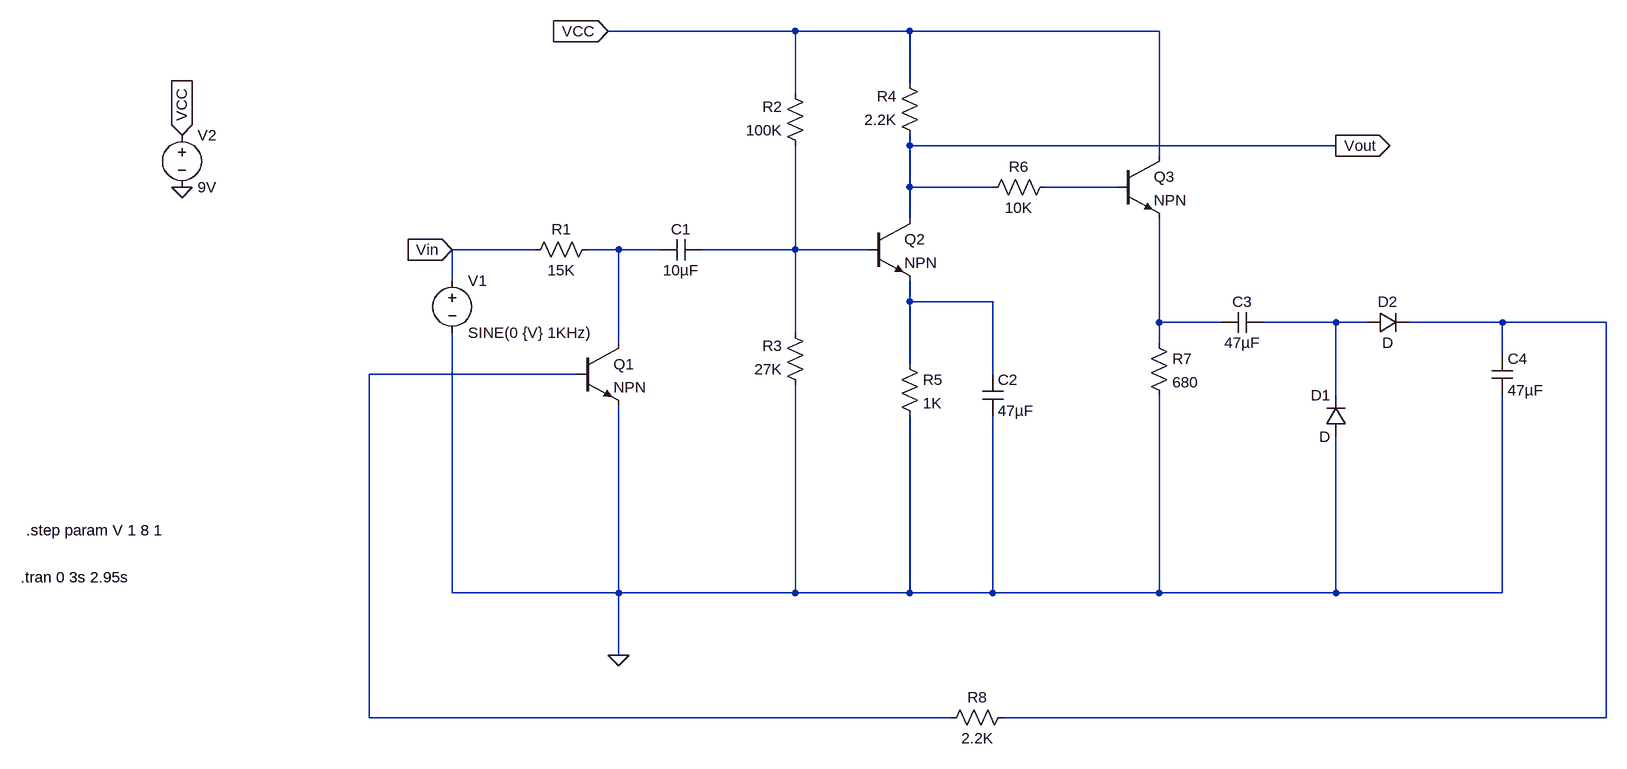
[diagram p0: schematic agc_BJT.asc]
agc_BJT.asc, the LTspice schematic file:
Version 4
SHEET 1 1796 864
WIRE 544 -240 256 -240
WIRE 720 -240 544 -240
WIRE 1104 -240 720 -240
WIRE 720 -160 720 -240
WIRE 544 -144 544 -240
WIRE 720 -64 720 -80
WIRE 1376 -64 720 -64
WIRE 1104 -48 1104 -240
WIRE 720 0 720 -64
WIRE 848 0 720 0
WIRE 1040 0 928 0
WIRE 720 48 720 0
WIRE 144 96 16 96
WIRE 272 96 224 96
WIRE 336 96 272 96
WIRE 544 96 544 -64
WIRE 544 96 400 96
WIRE 656 96 544 96
WIRE 16 144 16 96
WIRE 720 176 720 144
WIRE 848 176 720 176
WIRE 1104 208 1104 48
WIRE 1200 208 1104 208
WIRE 1376 208 1264 208
WIRE 1424 208 1376 208
WIRE 1632 208 1488 208
WIRE 1792 208 1632 208
WIRE 544 224 544 96
WIRE 272 240 272 96
WIRE 1104 240 1104 208
WIRE 1632 256 1632 208
WIRE 720 272 720 176
WIRE 208 288 -112 288
WIRE 848 288 848 176
WIRE 1376 320 1376 208
WIRE 16 624 16 224
WIRE 272 624 272 336
WIRE 272 624 16 624
WIRE 544 624 544 304
WIRE 544 624 272 624
WIRE 720 624 720 352
WIRE 720 624 544 624
WIRE 848 624 848 352
WIRE 848 624 720 624
WIRE 1104 624 1104 320
WIRE 1104 624 848 624
WIRE 1376 624 1376 384
WIRE 1376 624 1104 624
WIRE 1632 624 1632 320
WIRE 1632 624 1376 624
WIRE 272 720 272 624
WIRE -112 816 -112 288
WIRE 784 816 -112 816
WIRE 1792 816 1792 208
WIRE 1792 816 864 816
FLAG 272 720 0
FLAG 256 -240 VCC
IOPIN 256 -240 In
FLAG -400 0 0
FLAG -400 -80 VCC
IOPIN -400 -80 In
FLAG 1376 -64 Vout
IOPIN 1376 -64 Out
FLAG 16 96 Vin
IOPIN 16 96 In
SYMBOL voltage 16 128 R0
WINDOW 123 0 0 Left 0
WINDOW 39 0 0 Left 0
SYMATTR InstName V1
SYMATTR Value SINE(0 {V} 1KHz)
SYMBOL res 240 80 R90
WINDOW 0 0 56 VBottom 2
WINDOW 3 32 56 VTop 2
SYMATTR InstName R1
SYMATTR Value 15K
SYMBOL res 560 -48 R180
WINDOW 0 36 76 Left 2
WINDOW 3 36 40 Left 2
SYMATTR InstName R2
SYMATTR Value 100K
SYMBOL res 560 320 R180
WINDOW 0 36 76 Left 2
WINDOW 3 36 40 Left 2
SYMATTR InstName R3
SYMATTR Value 27K
SYMBOL cap 400 80 R90
WINDOW 0 0 32 VBottom 2
WINDOW 3 32 32 VTop 2
SYMATTR InstName C1
SYMATTR Value 10µF
SYMBOL npn 208 240 R0
SYMATTR InstName Q1
SYMBOL npn 656 48 R0
SYMATTR InstName Q2
SYMBOL npn 1040 -48 R0
SYMATTR InstName Q3
SYMBOL res 736 -64 R180
WINDOW 0 36 76 Left 2
WINDOW 3 36 40 Left 2
SYMATTR InstName R4
SYMATTR Value 2.2K
SYMBOL res 704 256 R0
SYMATTR InstName R5
SYMATTR Value 1K
SYMBOL cap 832 288 R0
SYMATTR InstName C2
SYMATTR Value 47µF
SYMBOL res 944 -16 R90
WINDOW 0 0 56 VBottom 2
WINDOW 3 32 56 VTop 2
SYMATTR InstName R6
SYMATTR Value 10K
SYMBOL res 1088 224 R0
SYMATTR InstName R7
SYMATTR Value 680
SYMBOL cap 1264 192 R90
WINDOW 0 0 32 VBottom 2
WINDOW 3 32 32 VTop 2
SYMATTR InstName C3
SYMATTR Value 47µF
SYMBOL diode 1392 384 R180
WINDOW 0 24 64 Left 2
WINDOW 3 24 0 Left 2
SYMATTR InstName D1
SYMBOL diode 1424 224 R270
WINDOW 0 32 32 VTop 2
WINDOW 3 0 32 VBottom 2
SYMATTR InstName D2
SYMBOL cap 1616 256 R0
SYMATTR InstName C4
SYMATTR Value 47µF
SYMBOL voltage -400 -96 R0
WINDOW 123 0 0 Left 0
WINDOW 39 0 0 Left 0
SYMATTR InstName V2
SYMATTR Value 9V
SYMBOL res 880 800 R90
WINDOW 0 0 56 VBottom 2
WINDOW 3 32 56 VTop 2
SYMATTR InstName R8
SYMATTR Value 2.2K
TEXT -640 528 Left 2 !.step param V 1 8 1
TEXT -648 600 Left 2 !.tran 0 3s 2.95s

The netlist it stands for:
* agc_BJT.asc
V1 Vin 0 SINE(0 {V} 1KHz)
R1 N002 Vin 15K
R2 N003 VCC 100K
R3 0 N003 27K
C1 N003 N002 10µF
Q1 N002 N008 0 0 NPN
Q2 Vout N003 N004 0 NPN
Q3 VCC N001 N005 0 NPN
R4 Vout VCC 2.2K
R5 N004 0 1K
C2 N004 0 47µF
R6 N001 Vout 10K
R7 N005 0 680
C3 N006 N005 47µF
D1 0 N006 D
D2 N006 N007 D
C4 N007 0 47µF
V2 VCC 0 9V
R8 N007 N008 2.2K
.model D D
.lib standard.dio
.model NPN NPN
.model PNP PNP
.lib standard.bjt
.step param V 1 8 1
.tran 0 3s 2.95s
.backanno
.end